# EAGLE design Program Counter (EAGLE 9.6.2)
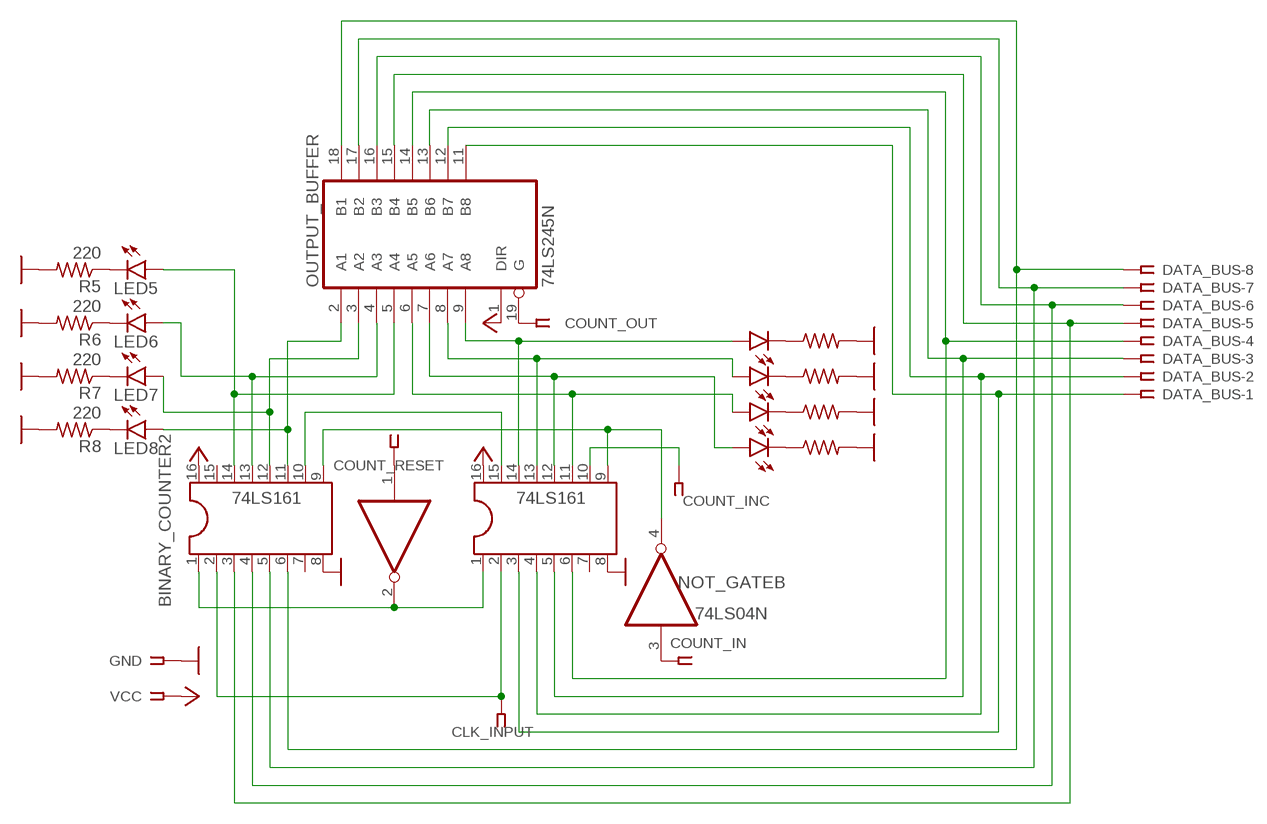
[diagram p0: schematic, sheet 1]

## Parts
BINARY_COUNTER  74LS161  DIL16  [DIL16]
BINARY_COUNTER2  74LS161  DIL16  [DIL16]
CLK_INPUT  SSW-101-02-G-S-RA  [SSW-101-02-G-S-RA]
COUNT_IN  SSW-101-02-G-S-RA  [SSW-101-02-G-S-RA]
COUNT_INC  SSW-101-02-G-S-RA  [SSW-101-02-G-S-RA]
COUNT_OUT  SSW-101-02-G-S-RA  [SSW-101-02-G-S-RA]
COUNT_RESET  SSW-101-02-G-S-RA  [SSW-101-02-G-S-RA]
DATA_BUS  SSW-108-02-G-S  [SSW-108-02-G-S]
GND  SSW-101-02-G-S-RA  [SSW-101-02-G-S-RA]
LED1  LED5MM  [LED5MM]
LED2  LED5MM  [LED5MM]
LED3  LED5MM  [LED5MM]
LED4  LED5MM  [LED5MM]
LED5  LED5MM  [LED5MM]
LED6  LED5MM  [LED5MM]
LED7  LED5MM  [LED5MM]
LED8  LED5MM  [LED5MM]
NOT_GATE  74LS04N  [DIL14]
OUTPUT_BUFFER  74LS245N  [DIL20]
R1  220  R-US_0204/7  [0204/7]
R2  220  R-US_0204/7  [0204/7]
R3  220  R-US_0204/7  [0204/7]
R4  220  R-US_0204/7  [0204/7]
R5  220  R-US_0204/7  [0204/7]
R6  220  R-US_0204/7  [0204/7]
R7  220  R-US_0204/7  [0204/7]
R8  220  R-US_0204/7  [0204/7]
VCC  SSW-101-02-G-S-RA  [SSW-101-02-G-S-RA]

## Nets
GND: BINARY_COUNTER2.8 BINARY_COUNTER.8 GND.1 R1.2 R2.2 R3.2 R4.2 R5.2 R6.2 R7.2 R8.2
N$1: BINARY_COUNTER2.2 BINARY_COUNTER.2 CLK_INPUT.1
N$2: BINARY_COUNTER2.1 BINARY_COUNTER.1 NOT_GATE.2(A:O)
N$3: LED1.K(C) R1.1
N$4: BINARY_COUNTER2.9 BINARY_COUNTER.9 NOT_GATE.4(B:O)
N$5: BINARY_COUNTER.10 COUNT_INC.1
N$6: BINARY_COUNTER2.10 BINARY_COUNTER.15
N$7: BINARY_COUNTER.14 LED1.A OUTPUT_BUFFER.9(A8)
N$8: BINARY_COUNTER.13 LED2.A OUTPUT_BUFFER.8(A7)
N$9: BINARY_COUNTER.12 LED3.A OUTPUT_BUFFER.7(A6)
N$10: BINARY_COUNTER.11 LED4.A OUTPUT_BUFFER.6(A5)
N$11: BINARY_COUNTER2.11 LED8.A OUTPUT_BUFFER.2(A1)
N$12: COUNT_RESET.1 NOT_GATE.1(A:I)
N$13: BINARY_COUNTER2.13 LED6.A OUTPUT_BUFFER.4(A3)
N$14: COUNT_IN.1 NOT_GATE.3(B:I)
N$15: BINARY_COUNTER.3 DATA_BUS.1 OUTPUT_BUFFER.11(B8)
N$16: BINARY_COUNTER.4 DATA_BUS.2 OUTPUT_BUFFER.12(B7)
N$17: BINARY_COUNTER.5 DATA_BUS.3 OUTPUT_BUFFER.13(B6)
N$18: BINARY_COUNTER.6 DATA_BUS.4 OUTPUT_BUFFER.14(B5)
N$19: BINARY_COUNTER2.3 DATA_BUS.5 OUTPUT_BUFFER.15(B4)
N$20: BINARY_COUNTER2.4 DATA_BUS.6 OUTPUT_BUFFER.16(B3)
N$21: BINARY_COUNTER2.5 DATA_BUS.7 OUTPUT_BUFFER.17(B2)
N$22: BINARY_COUNTER2.6 DATA_BUS.8 OUTPUT_BUFFER.18(B1)
N$23: LED2.K(C) R2.1
N$24: LED3.K(C) R3.1
N$25: LED4.K(C) R4.1
N$26: LED5.K(C) R5.1
N$27: LED6.K(C) R6.1
N$28: LED7.K(C) R7.1
N$29: LED8.K(C) R8.1
N$30: COUNT_OUT.1 OUTPUT_BUFFER.19(G)
N$32: BINARY_COUNTER2.12 LED7.A OUTPUT_BUFFER.3(A2)
N$33: BINARY_COUNTER2.14 LED5.A OUTPUT_BUFFER.5(A4)
VCC: BINARY_COUNTER2.16 BINARY_COUNTER.16 OUTPUT_BUFFER.1(DIR) VCC.1
Unconnected: BINARY_COUNTER2.7 BINARY_COUNTER2.15 BINARY_COUNTER.7 NOT_GATE.5(C:I) NOT_GATE.6(C:O) NOT_GATE.8(D:O) NOT_GATE.9(D:I) NOT_GATE.10(E:O) NOT_GATE.11(E:I) NOT_GATE.12(F:O) NOT_GATE.13(F:I)

## Power pins joined to a net without a drawn wire
GND: NOT_GATE.7(P:GND) OUTPUT_BUFFER.10(GND)
VCC: NOT_GATE.14(P:VCC) OUTPUT_BUFFER.20(VCC)

## Library data of the parts
BINARY_COUNTER BINARY_COUNTER2 = ic-package:DIL16: Dual In Line / Socket
CLK_INPUT COUNT_IN COUNT_INC COUNT_OUT COUNT_RESET GND VCC = con-samtec:SSW-101-02-G-S: THROUGH-HOLE .025" SQ POST SOCKET Source: Samtec SSW.pdf; MF: Samtec Inc.; MPN: SSW-101-02-G-S-RA; OC_FARNELL: unknown; OC_NEWARK: 11P9337
DATA_BUS = con-samtec:SSW-108-02-G-S: THROUGH-HOLE .025" SQ POST SOCKET Source: Samtec SSW.pdf; MF: Samtec Inc.; MPN: SSW-108-02-G-S; OC_FARNELL: unknown; OC_NEWARK: 11P9448
LED1-LED8 = led:LED: LED OSRAM: - CHIPLED LG R971, LG N971, LY N971, LG Q971, LY Q971, LO R971, LY R971 LH N974, LH R974 LS Q976, LO Q976, LY Q976 LO Q996 - Hyper CHIPLED LW Q18S LB Q993, LB Q99A, LB R99A - SideLED LS A670, LO A670, LY A670, LG A670, LP A670 LB A673, LV A673, LT A673, LW A673 LH A674 LY A675 LS A676, LA A676, LO A676, LY A676, LW A676 LS A679, LY A679, LG A679 - Hyper Micro SIDELED® LS Y876, LA Y876, LO Y876, LY Y876 LT Y87S - SmartLED LW L88C, LW L88S LB L89C, LB L89S, LG L890 LS L89K, LO L89K, LY L89K LS L896, LA L896, LO L896, LY L896 - TOPLED LS T670, LO T670, LY T670, LG T670, LP T670 LSG T670, LSP T670, LSY T670, LOP T670, LYG T670 LG T671, LOG T671, LSG T671 LB T673, LV T673, LT T673, LW T673 LH T674 LS T676, LA T676, LO T676, LY T676, LB T676, LH T676, LSB T676, LW T676 LB T67C, LV T67C, LT T67C, LS T67K, LO T67K, LY T67K, LW E67C LS E67B, LA E67B, LO E67B, LY E67B, LB E67C, LV E67C, LT E67C LW T67C LS T679, LY T679, LG T679 LS T770, LO T770, LY T770, LG T770, LP T770 LB T773, LV T773, LT T773, LW T773 LH T774 LS E675, LA E675, LY E675, LS T675 LS T776, LA T776, LO T776, LY T776, LB T776 LHGB T686 LT T68C, LB T68C - Hyper Mini TOPLED® LB M676 - Mini TOPLED Santana® LG M470 LS M47K, LO M47K, LY M47K Source: http://www.osram.convergy.de LUXEON: - LUMILED® LXK2-PW12-R00, LXK2-PW12-S00, LXK2-PW14-U00, LXK2-PW14-V00 LXK2-PM12-R00, LXK2-PM12-S00, LXK2-PM14-U00 LXK2-PE12-Q00, LXK2-PE12-R00, LXK2-PE12-S00, LXK2-PE14-T00, LXK2-PE14-U00 LXK2-PB12-K00, LXK2-PB12-L00, LXK2-PB12-M00, LXK2-PB14-N00, LXK2-PB14-P00, LXK2-PB14-Q00 LXK2-PR12-L00, LXK2-PR12-M00, LXK2-PR14-Q00, LXK2-PR14-R00 LXK2-PD12-Q00, LXK2-PD12-R00, LXK2-PD12-S00 LXK2-PH12-R00, LXK2-PH12-S00 LXK2-PL12-P00, LXK2-PL12-Q00, LXK2-PL12-R00 Source: www.luxeon.com KINGBRIGHT: KA-3528ASYC Source: www.kingbright.com
NOT_GATE = 74xx-eu:74*04: Hex INVERTER
OUTPUT_BUFFER = 74xx-eu:74*245: Octal BUS TRANSCEIVER, 3-state
R1-R8 = rcl:R-US_: RESISTOR, American symbol; SPICEPREFIX: R

## Board
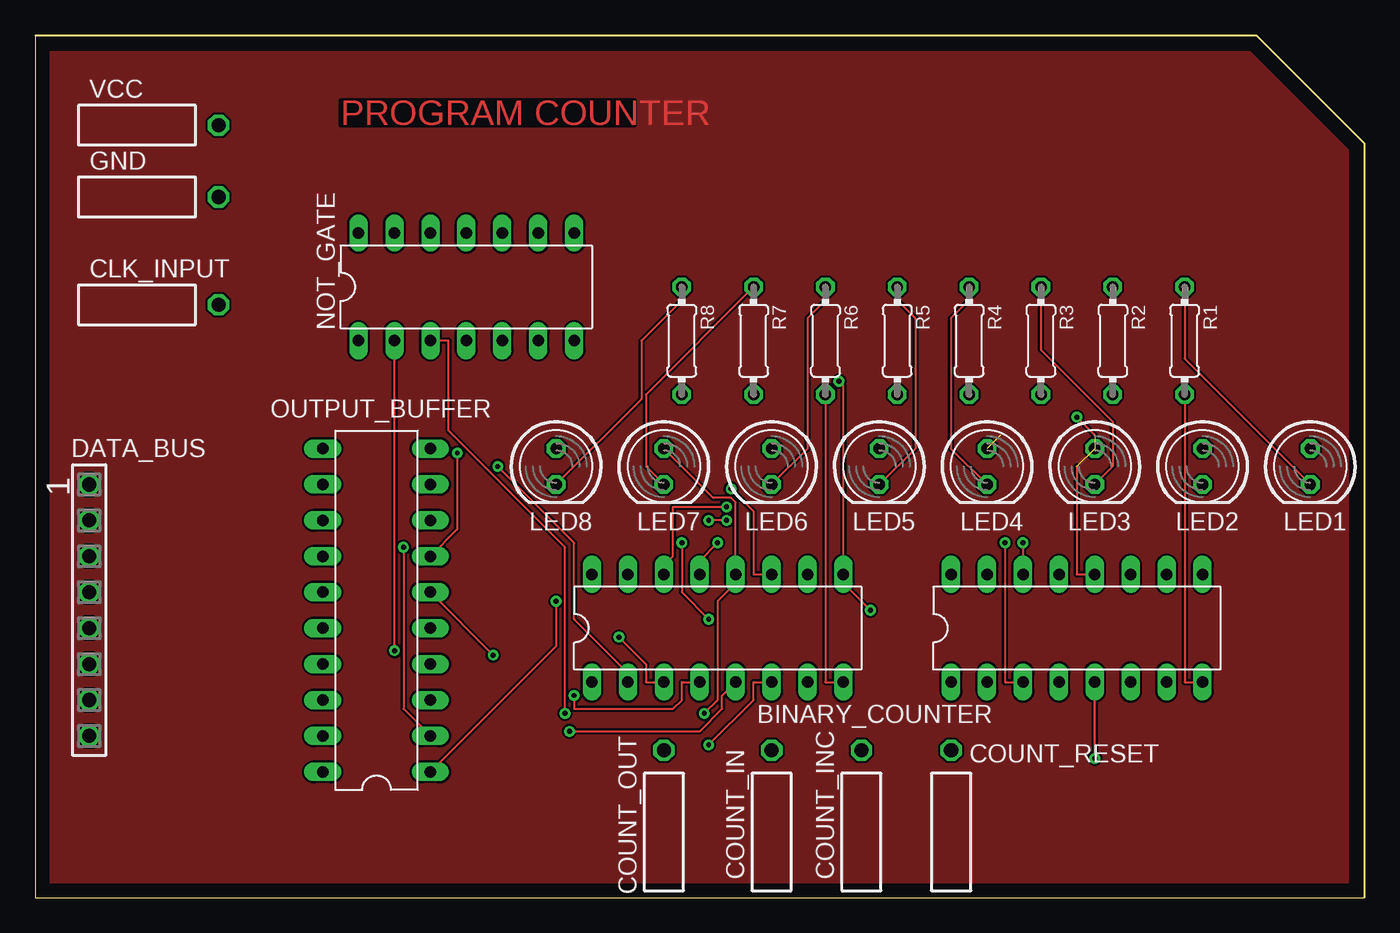
[diagram p1: board, top side]
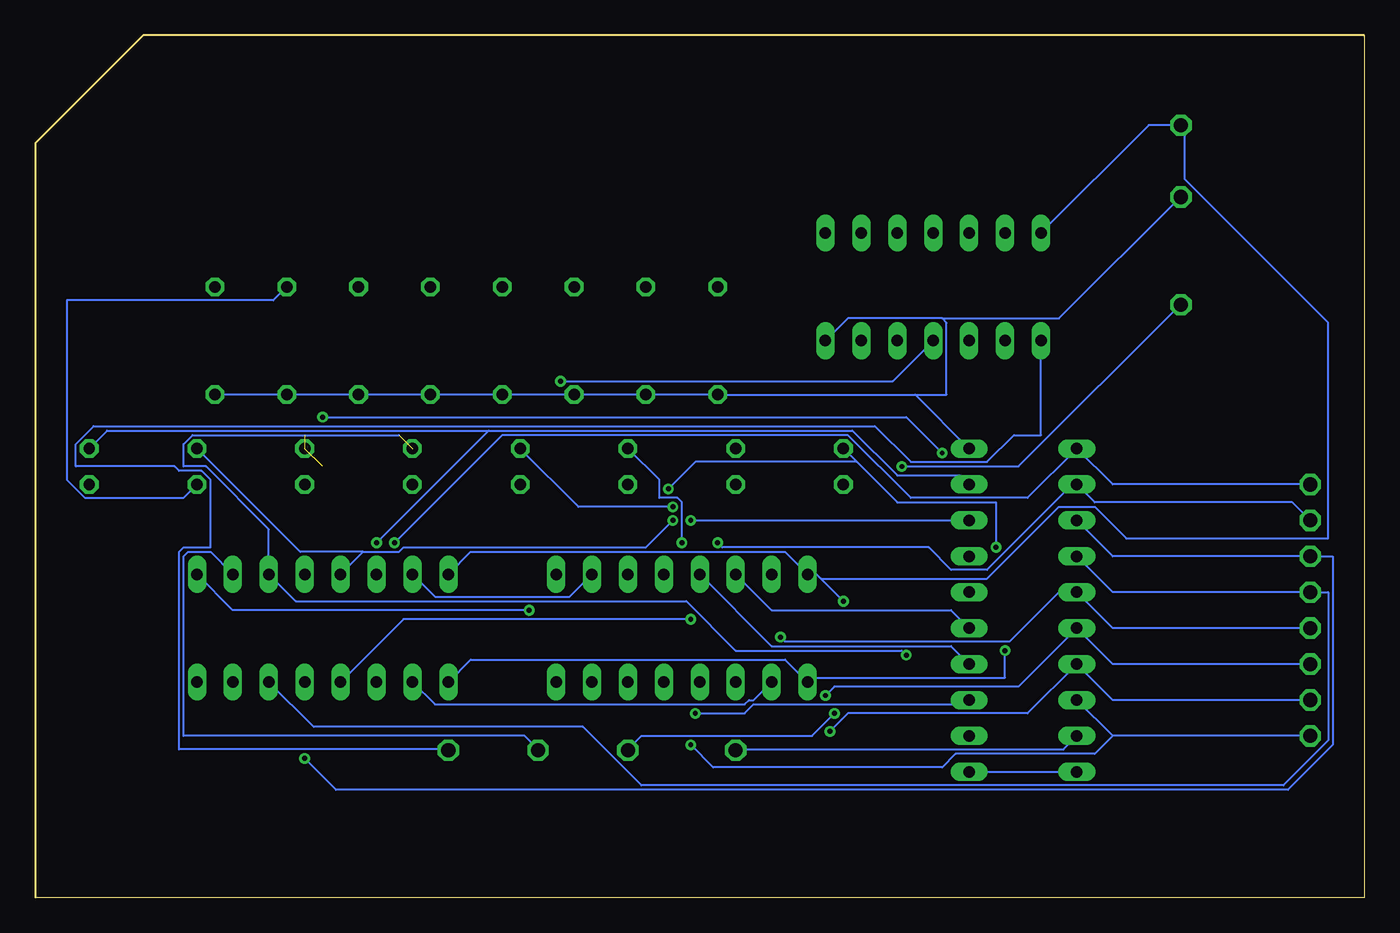
[diagram p2: board, bottom side, seen from below]

Size 93.98 x 60.96 mm. Coordinates in mm from the lower left corner, seen from the top.
Outline: 0,0 93.98,0 93.98,53.34 86.36,60.96 0,60.96 0,0
Copper layers (1*16): Top 0.035mm / dielectric 1.5mm / Bottom 0.035mm
Design rules "default": minimum track width 6mil, minimum drill 0.35mm, track to track 6mil, track to pad 6mil, pad to pad 6mil, via to via 6mil, smd to smd 6mil, copper to edge 40mil, drill to drill 6mil, minimum pad ring 10mil, minimum via ring 8mil, stop-mask expansion 4mil, vias tented up to drill 0mil, thermal gap 10mil

### Footprints (pad centres in the part's own frame; a part is rotated, then mirrored left to right if it is on the bottom)
DIL16 = drill 0.813 long: 1 -8.89,-3.81; 2 -6.35,-3.81; 3 -3.81,-3.81; 4 -1.27,-3.81; 5 1.27,-3.81; 6 3.81,-3.81; 7 6.35,-3.81; 8 8.89,-3.81; 9 8.89,3.81; 10 6.35,3.81; 11 3.81,3.81; 12 1.27,3.81; 13 -1.27,3.81; 14 -3.81,3.81; 15 -6.35,3.81; 16 -8.89,3.81
SSW-101-02-G-S-RA = drill 1 pad 1.5 octagon: 1 0,1.524
SSW-108-02-G-S = drill 1 pad 1.5 octagon: 1 -8.89,0; 2 -6.35,0; 3 -3.81,0; 4 -1.27,0; 5 1.27,0; 6 3.81,0; 7 6.35,0; 8 8.89,0
LED5MM = drill 0.813 octagon: A -1.27,0; K 1.27,0
DIL14 = drill 0.813 long: 1 -7.62,-3.81; 2 -5.08,-3.81; 3 -2.54,-3.81; 4 0,-3.81; 5 2.54,-3.81; 6 5.08,-3.81; 7 7.62,-3.81; 8 7.62,3.81; 9 5.08,3.81; 10 2.54,3.81; 11 0,3.81; 12 -2.54,3.81; 13 -5.08,3.81; 14 -7.62,3.81
DIL20 = drill 0.813 long: 1 -11.43,-3.81; 2 -8.89,-3.81; 3 -6.35,-3.81; 4 -3.81,-3.81; 5 -1.27,-3.81; 6 1.27,-3.81; 7 3.81,-3.81; 8 6.35,-3.81; 9 8.89,-3.81; 10 11.43,-3.81; 11 11.43,3.81; 12 8.89,3.81; 13 6.35,3.81; 14 3.81,3.81; 15 1.27,3.81; 16 -1.27,3.81; 17 -3.81,3.81; 18 -6.35,3.81; 19 -8.89,3.81; 20 -11.43,3.81
0204/7 = drill 0.813 octagon: 1 -3.81,0; 2 3.81,0

### Placement (x,y rotation side)
BINARY_COUNTER  73.66,19.05 0 top
BINARY_COUNTER2  48.26,19.05 0 top
CLK_INPUT  11.43,41.91 270 top
COUNT_IN  52.07,8.89 0 top
COUNT_INC  58.42,8.89 0 top
COUNT_OUT  44.45,8.89 0 top
COUNT_RESET  64.77,8.89 0 top
DATA_BUS  3.81,20.32 270 top
GND  11.43,49.53 270 top
LED1  90.17,30.48 270 top
LED2  82.55,30.48 270 top
LED3  74.93,30.48 270 top
LED4  67.31,30.48 270 top
LED5  59.69,30.48 270 top
LED6  52.07,30.48 270 top
LED7  44.45,30.48 270 top
LED8  36.83,30.48 270 top
NOT_GATE  30.48,43.18 0 top
OUTPUT_BUFFER  24.13,20.32 90 top
R1  81.28,39.37 270 top
R2  76.2,39.37 270 top
R3  71.12,39.37 270 top
R4  66.04,39.37 270 top
R5  60.96,39.37 270 top
R6  55.88,39.37 270 top
R7  50.8,39.37 270 top
R8  45.72,39.37 270 top
VCC  11.43,54.61 270 top

### Tracks (layer width: path | path; a pad name or v marks a point on that pad's centre or on a via)
GND
  Top 0.152: BINARY_COUNTER2.8 55.88,15.24 R6.2 | BINARY_COUNTER.8 81.28,15.24 R1.2
  Bottom 0.152: 31.75,35.56 OUTPUT_BUFFER.10 | 31.75,35.56 R8.2 R7.2 R6.2 R5.2 R4.2 R3.2 R2.2 R1.2 | NOT_GATE.7 36.51,40.96 29.84,40.96 | 29.84,40.96 29.53,40.64 29.53,35.56 31.75,35.56 | 29.84,40.96 21.59,40.96 13.02,49.53 GND.1
MAIN
  pour Top: 0,60.96 86.36,60.96 93.98,53.34 93.98,0 0,0
N$1  (via drill 0.35)
  Top 0.152: v32.7,30.48 38.1,25.08 38.1,19.68 41.91,15.88 BINARY_COUNTER2.2
  Bottom 0.152: BINARY_COUNTER2.2 43.18,13.97 43.5,13.97 43.81,13.65 65.72,13.65 BINARY_COUNTER.2 | v32.7,30.48 24.45,30.48 13.02,41.91 CLK_INPUT.1
N$2  (via drill 0.35)
  Top 0.152: v25.4,17.46 NOT_GATE.2
  Bottom 0.152: 39.69,15.56 40.96,16.83 63.18,16.83 BINARY_COUNTER.1 | v25.4,17.46 25.4,15.56 39.69,15.56 | 39.69,15.56 BINARY_COUNTER2.1
N$3
  Top 0.152: LED1.K 81.28,38.1 R1.1
N$4  (via drill 0.35)
  Top 0.152: v56.83,36.51 57.15,36.2 BINARY_COUNTER2.9 57.15,22.23 v59.05,20.32
  Bottom 0.152: NOT_GATE.4 33.34,36.51 v56.83,36.51 | BINARY_COUNTER.9 80.01,20.32 v59.05,20.32
N$5
  Bottom 0.152: BINARY_COUNTER.10 81.6,24.45 83.19,24.45 83.5,24.13 83.5,11.43 59.37,11.43 58.42,10.48 COUNT_INC.1
N$6
  Bottom 0.152: BINARY_COUNTER2.10 56.2,21.27 65.72,21.27 BINARY_COUNTER.15
N$7  (via drill 0.35)
  Top 0.152: v69.85,25.08 BINARY_COUNTER.14
  Bottom 0.152: OUTPUT_BUFFER.9 28.57,29.84 33.02,29.84 36.2,33.02 61.91,33.02 | 61.91,33.02 88.9,33.02 LED1.A | 61.91,33.02 v69.85,25.08
N$8  (via drill 0.35)
  Top 0.152: v48.9,26.67 v47.62,26.67
  Bottom 0.152: v47.62,26.67 OUTPUT_BUFFER.8 | v48.9,26.67 50.8,24.77 67.94,24.77 68.26,24.45 70.8,24.45 | BINARY_COUNTER.13 70.8,24.45 | LED2.A 75.25,24.45 70.8,24.45
N$9  (via drill 0.35)  (2 unrouted)
  Top 0.152: OUTPUT_BUFFER.7 29.84,26.04 v29.84,31.43 | 74.93,32.7 v73.66,33.97 | BINARY_COUNTER.12 73.66,22.86 73.66,30.48
  Bottom 0.152: v29.84,31.43 32.38,33.97 v73.66,33.97
N$10  (via drill 0.35)  (1 unrouted)
  Top 0.152: v32.38,17.14 OUTPUT_BUFFER.6
  Bottom 0.152: v32.38,17.14 32.7,17.46 44.45,17.46 47.94,20.95 75.56,20.95 BINARY_COUNTER.11 77.47,26.04 81.92,30.48 83.5,30.48 83.5,32.07 82.87,32.7 68.26,32.7
N$11  (via drill 0.35)
  Top 0.152: OUTPUT_BUFFER.2 26.04,13.34 v26.04,24.77 | BINARY_COUNTER2.11 50.8,22.86 50.8,27.3 v49.21,28.89
  Bottom 0.152: v26.04,24.77 26.04,27.94 33.02,27.94 35.88,30.8 | LED8.A 35.88,30.8 | v49.21,28.89 47.31,30.8 35.88,30.8
N$12
  Bottom 0.152: NOT_GATE.1 22.86,32.7 24.77,32.7 26.67,30.8 32.07,30.8 34.61,33.34 89.85,33.34 91.12,32.07 91.12,30.48 84.14,30.48 83.82,30.16 82.23,30.16 81.6,29.53 81.6,24.77 83.5,24.77 83.82,24.45 83.82,10.48 64.77,10.48 COUNT_RESET.1
N$13  (via drill 0.35)
  Top 0.152: v48.26,25.08 46.99,23.81 BINARY_COUNTER2.13
  Bottom 0.152: OUTPUT_BUFFER.4 29.21,17.78 41.91,17.78 BINARY_COUNTER2.13 | LED6.A 49.85,29.53 49.85,28.26 48.58,28.26 48.26,27.94 v48.26,25.08
N$14  (via drill 0.35)
  Top 0.152: NOT_GATE.3 29.21,39.37 29.21,33.02 37.47,24.77 v37.47,13.02
  Bottom 0.152: v37.47,13.02 39.05,11.43 51.12,11.43 52.07,10.48 COUNT_IN.1
N$15  (via drill 0.35)
  Top 0.152: BINARY_COUNTER.3 68.58,15.24 v68.58,25.08
  Bottom 0.152: DATA_BUS.1 17.78,29.21 OUTPUT_BUFFER.11 23.81,28.26 32.07,28.26 36.51,32.7 60.96,32.7 v68.58,25.08
N$16  (via drill 0.35)
  Top 0.152: v47.62,19.68 45.72,21.59 v45.72,25.08
  Bottom 0.152: DATA_BUS.2 5.08,27.94 19.05,27.94 OUTPUT_BUFFER.12 20.64,29.21 26.67,23.18 29.21,23.18 30.8,24.77 45.4,24.77 v45.72,25.08 | BINARY_COUNTER.4 67.94,19.68 v47.62,19.68
N$17  (via drill 0.35)
  Top 0.152: v74.93,9.84 BINARY_COUNTER.5
  Bottom 0.152: OUTPUT_BUFFER.13 17.78,24.13 DATA_BUS.3 2.22,24.13 2.22,10.79 5.4,7.62 72.71,7.62 v74.93,9.84
N$18
  Bottom 0.152: OUTPUT_BUFFER.14 17.78,21.59 DATA_BUS.4 2.54,21.59 2.54,11.11 5.71,7.94 51.12,7.94 55.24,12.06 74.3,12.06 BINARY_COUNTER.6
N$19  (via drill 0.35)
  Top 0.152: BINARY_COUNTER2.3 43.18,15.24 43.18,16.51 v41.27,18.41
  Bottom 0.152: DATA_BUS.5 17.78,19.05 OUTPUT_BUFFER.15 21.59,21.59 25.08,18.1 40.96,18.1 v41.27,18.41
N$20  (via drill 0.35)
  Top 0.152: BINARY_COUNTER2.4 45.72,15.24 45.72,13.97 45.09,13.34 38.1,13.34 v38.1,14.29
  Bottom 0.152: DATA_BUS.6 17.78,16.51 OUTPUT_BUFFER.16 24.45,14.92 37.47,14.92 v38.1,14.29
N$21  (via drill 0.35)
  Top 0.152: BINARY_COUNTER2.5 48.58,14.29 48.58,13.34 46.99,11.75 v37.78,11.75
  Bottom 0.152: DATA_BUS.7 17.78,13.97 OUTPUT_BUFFER.17 23.81,13.02 36.51,13.02 v37.78,11.75
N$22  (via drill 0.35)
  Top 0.152: BINARY_COUNTER2.6 50.8,15.24 50.8,13.97 v47.62,10.79
  Bottom 0.152: 17.78,11.43 OUTPUT_BUFFER.18 | DATA_BUS.8 17.78,11.43 | v47.62,10.79 46.04,9.21 29.84,9.21 28.89,10.16 19.05,10.16 17.78,11.43
N$23
  Bottom 0.152: LED2.K 83.5,28.26 90.49,28.26 91.76,29.53 91.76,42.23 77.15,42.23 R2.1
N$24
  Top 0.152: LED3.K 76.2,30.48 76.2,33.66 71.12,38.73 R3.1
N$25
  Top 0.152: LED4.K 64.77,31.75 64.77,40.96 66.04,42.23 R4.1
N$26
  Top 0.152: LED5.K 62.23,31.75 62.23,40.96 60.96,42.23 R5.1
N$27
  Top 0.152: LED6.K 54.61,31.75 54.61,40.96 55.88,42.23 R6.1
N$28
  Top 0.152: LED7.K 43.18,30.48 43.18,35.56 R7.1
N$29
  Top 0.152: LED8.K 42.86,35.24 42.86,39.37 45.72,42.23 R8.1
N$30
  Bottom 0.152: OUTPUT_BUFFER.19 21.27,10.48 44.45,10.48 COUNT_OUT.1
N$32  (via drill 0.35)
  Top 0.152: v47.31,13.02 48.26,13.97 48.26,20.95 49.53,22.23 BINARY_COUNTER2.12 49.53,27.94 49.21,28.26 47.94,28.26 LED7.A
  Bottom 0.152: OUTPUT_BUFFER.3 28.26,13.65 43.18,13.65 43.81,13.02 v47.31,13.02
N$33  (via drill 0.35)
  Top 0.152: v48.9,27.62 45.09,27.62 45.09,24.13 44.45,23.5 BINARY_COUNTER2.14
  Bottom 0.152: OUTPUT_BUFFER.5 29.21,20.32 41.91,20.32 BINARY_COUNTER2.14 | LED5.A 55.56,27.62 v48.9,27.62
VCC  (via drill 0.35)
  Top 0.152: OUTPUT_BUFFER.1 36.83,17.78 v36.83,20.95
  Bottom 0.152: NOT_GATE.14 15.24,54.61 VCC.1 12.7,54.61 12.7,50.8 2.54,40.64 2.54,25.4 16.83,25.4 19.05,27.62 21.59,27.62 26.67,22.54 38.42,22.54 | OUTPUT_BUFFER.1 OUTPUT_BUFFER.20 | BINARY_COUNTER.16 63.18,24.45 40.96,24.45 BINARY_COUNTER2.16 38.73,22.86 38.42,22.54 | 38.42,22.54 v36.83,20.95

### Text on the board
Top: PROGRAM COUNTER